# Altium schematic sheet bldc.SchDoc
size Tabloid; SheetNumber: 3; SheetTotal: 4; Page: BLDC
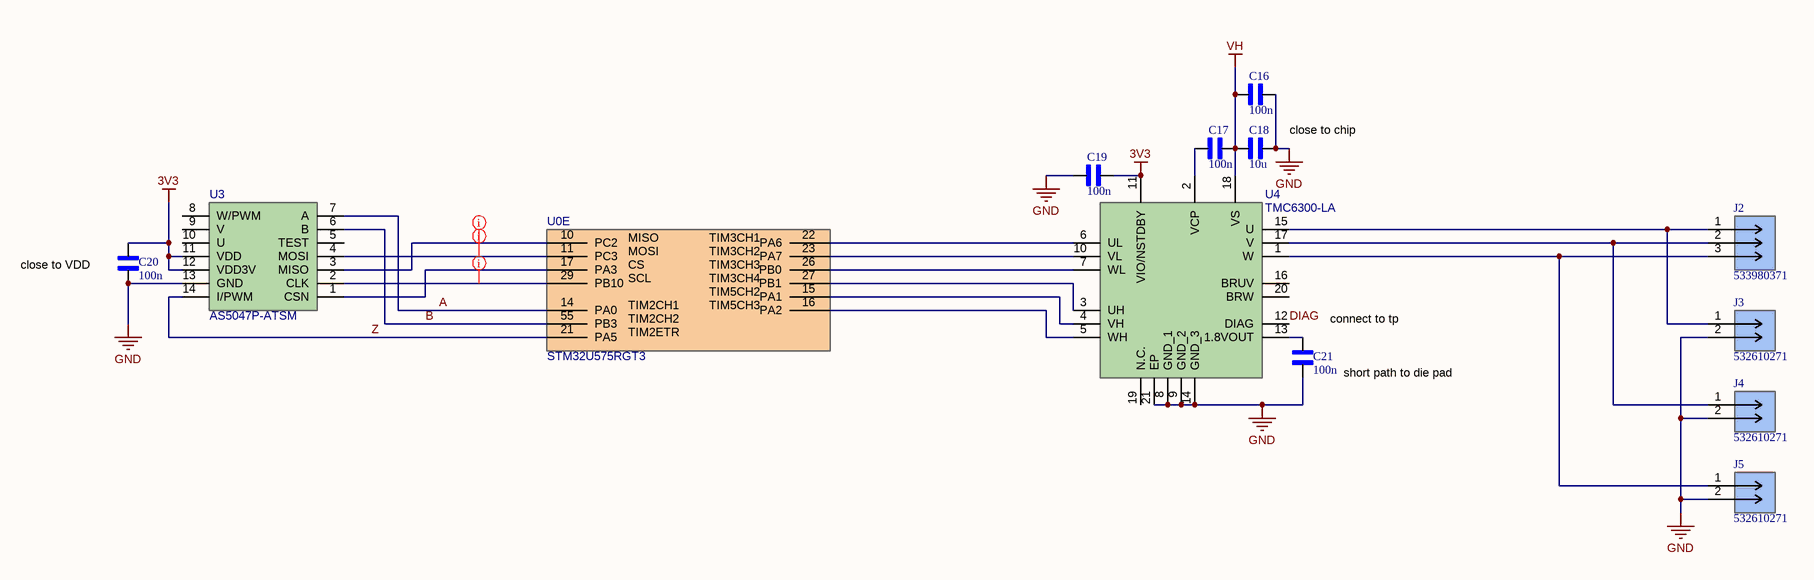
[diagram p0: bldc.SchDoc]

## Parts
C16  100n  [CAPC1005X55N]
C17  100n  [CAPC1005X55N]
C18  10u  [CAPC3225X270N]
C19  100n  [CAPC1005X55N]
C20  100n  [CAPC1005X55N]
C21  100n  [CAPC1005X55N]
J2  533980371  [CONN_53398_03_MOL]
J3  532610271  [CONN_532610001-SD_02_MOL]
J4  532610271  [CONN_532610001-SD_02_MOL]
J5  532610271  [CONN_532610001-SD_02_MOL]
U0  STM32U575RGT3  [QFP50P1200X1200X160-64N]  (part E of 5)
U3  AS5047P-ATSM  [SOP65P640X120-14N]
U4  TMC6300-LA  [QFN40P300X300X90-21N]

## Nets
3V3: C19.2 C20.2 U3.11(VDD) U3.12(VDD3V) U4.11(VIO/NSTDBY)
GND: C16.2 C18.2 C19.1 C20.1 C21.1 J3.2 J4.2 J5.2 U3.13(GND) U4.8(GND_1) U4.9(GND_2) U4.14(GND_3) U4.21(EP)
VH: C16.1 C17.2 C18.1 U4.18(VS)
A: U0.14(PA0) U3.7(A)
B: U0.55(PB3) U3.6(B)
DIAG: U4.12(DIAG)
Z: U0.21(PA5) U3.14(I/PWM)
NetC17_1: C17.1 U4.2(VCP)
NetC21_2: C21.2 U4.13(1.8VOUT)
NetJ2_1: J2.1 J3.1 U4.15(U)
NetJ2_2: J2.2 J4.1 U4.17(V)
NetJ2_3: J2.3 J5.1 U4.1(W)
NetU0_10: U0.10(PC2) U3.3(MISO)
NetU0_11: U0.11(PC3) U3.4(MOSI)
NetU0_15: U0.15(PA1) U4.4(VH)
NetU0_16: U0.16(PA2) U4.5(WH)
NetU0_17: U0.17(PA3) U3.1(CSN)
NetU0_22: U0.22(PA6) U4.6(UL)
NetU0_23: U0.23(PA7) U4.10(VL)
NetU0_26: U0.26(PB0) U4.7(WL)
NetU0_27: U0.27(PB1) U4.3(UH)
NetU0_29: U0.29(PB10) U3.2(CLK)

Not connected (* = marked no-connect by the designer): U3 5(TEST) 8(W/PWM) 9(V) 10(U); U4 16(BRUV) 19(N.C.) 20(BRW)

## Layout directives
net class SPI: NetU0_10, NetU0_11, NetU0_29

## Notes on the sheet
- close to chip
- (near C20) close to VDD
- (near C21) connect to tp
- (near C21) short path to die pad
- Board
- Page
- Author
- Date:
- File:
- (in symbol STM32U575RGT3, part E) MISO; TIM3CH1; MOSI; TIM3CH2; CS; TIM3CH3; SCL; TIM3CH4; TIM5CH2; TIM2CH1; TIM5CH3; TIM2CH2; TIM2ETR

## Library data of the parts
C16 C17 C19-C21 = UMK105B7104KVHF: CAP CER 0.1UF 50V X7R 0402; MF: {'manufacturer': u'Taiyo Yuden'}; Package: None; Price: None; Value: *; MP: UMK105B7104KVHF; Availability: Unavailable; Manufacturer_Part_Number: UMK105B7104KVHF
C18 = MSASU32MSB5106KPNA01: CAP CER 10UF 50V X5R 1210; MF: {'manufacturer': u'Taiyo Yuden'}; Package: None; Price: None; Value: *; MP: MSASU32MSB5106KPNA01; Availability: Unavailable; Manufacturer_Part_Number: MSASU32MSB5106KPNA01
J2 = 533980371: 1.25mm Pitch, PicoBlade PCB Header, Single Row, Vertical, Surface Mount,  Tin (Sn) Plating, Friction Lock, 3 Circuits, Tape and Reel, 0.60mm PC Tail Length; Manufacturer_Name: Molex Connector Corporation; Copyright: Copyright (C) 2025 Ultra Librarian. All rights reserved.; Manufacturer_Part_Number: 533980371; RefDes: RefDes; Type: Type
J3-J5 = 532610271: 1.25mm Pitch, PicoBlade PCB Header, Single Row, Right-Angle, Surface Mount, Tin (Sn) Plating, Friction Lock, 2 Circuits, Natural, Tape and Reel; Manufacturer_Name: Molex Connector Corporation; Copyright: Copyright (C) 2025 Ultra Librarian. All rights reserved.; Manufacturer_Part_Number: 532610271; RefDes: RefDes; Type: Type
U0 = STM32U575RGT3: Ultra-low-power Arm Cortex-M33 32-bit MCU+TrustZone+FPU, 240 DMIPS, up to 2 MB Flash memory, 786 KB SRAM; Manufacturer_Name: STMicroelectronics; Geometry.Height: 1.6mm; Manufacturer_Part_Number: STM32U575RGT3; Mouser Part Number: *; Mouser Price/Stock: *; Arrow Part Number: *; Arrow Price/Stock: *; Datasheet Link: https://www.st.com/resource/en/datasheet/stm32u575ag.pdf
U3 = AS5047P-ATSM: Board Mount Hall Effect / Magnetic Sensors 14 bit core res Up to 28krpm; Manufacturer_Name: ams OSRAM; Geometry.Height: 1.2mm; Mouser Part Number: 985-AS5047P-ATSM; Mouser Price/Stock: https://www.mouser.co.uk/ProductDetail/ams-OSRAM/AS5047P-ATSM?qs=cGEy3R83DS8fzNOVLHtOgg%3D%3D; Manufacturer_Part_Number: AS5047P-ATSM; Datasheet Link: https://datasheet.datasheetarchive.com/originals/distributors/DKDS-7/120640.pdf
U4 = TMC6300-LA: Highly Efficient Low Voltage, Zero Standby Current Driver for 3-Phase BLDC/PMSM Motors up to 2A peak, Triple Half-Bridge with separate HS and LS control signals; Manufacturer_Name: Analog Devices; Geometry.Height: 0.9mm; Manufacturer_Part_Number: TMC6300-LA; Mouser Part Number: 700-TMC6300-LA; Mouser Price/Stock: https://www.mouser.co.uk/ProductDetail/ADI-Trinamic/TMC6300-LA?qs=QNEnbhJQKvYIagO3WUG%252BYg%3D%3D; Arrow Part Number: TMC6300-LA; Arrow Price/Stock: https://www.arrow.com/en/products/tmc6300-la/analog-devices?region=nac; Datasheet Link: https://www.analog.com/TMC6300/datasheet